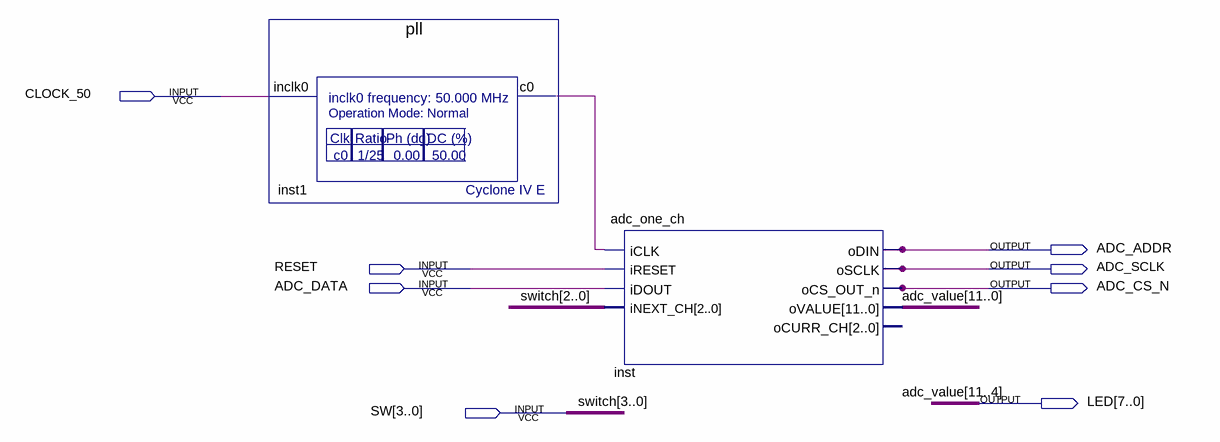
[diagram p0: schematic sheet]
// Quartus schematic adc_converter_one_ch.bdf as structural Verilog: 2 symbols, 8 pins
module adc_converter_one_ch (
  input  CLOCK_50,
  input  RESET,
  input  ADC_DATA,
  input  [3:0] SW,
  output ADC_ADDR,
  output ADC_SCLK,
  output ADC_CS_N,
  output [7:0] LED
);

  wire inst1_c0;
  wire [3:0] adc_value;

  pll inst1 (.inclk0(CLOCK_50), .c0(inst1_c0));
  adc_one_ch inst (
    .iCLK(inst1_c0), .iRESET(RESET), .iDOUT(ADC_DATA), .iNEXT_CH(SW[2:0]), .oDIN(ADC_ADDR), .oSCLK(ADC_SCLK),
    .oCS_OUT_n(ADC_CS_N), .oVALUE({LED, adc_value}));  // open: oCURR_CH

  // Other names for the same wires on the sheet: adc_value[11:4] = LED; switch[3:0] = SW
endmodule
